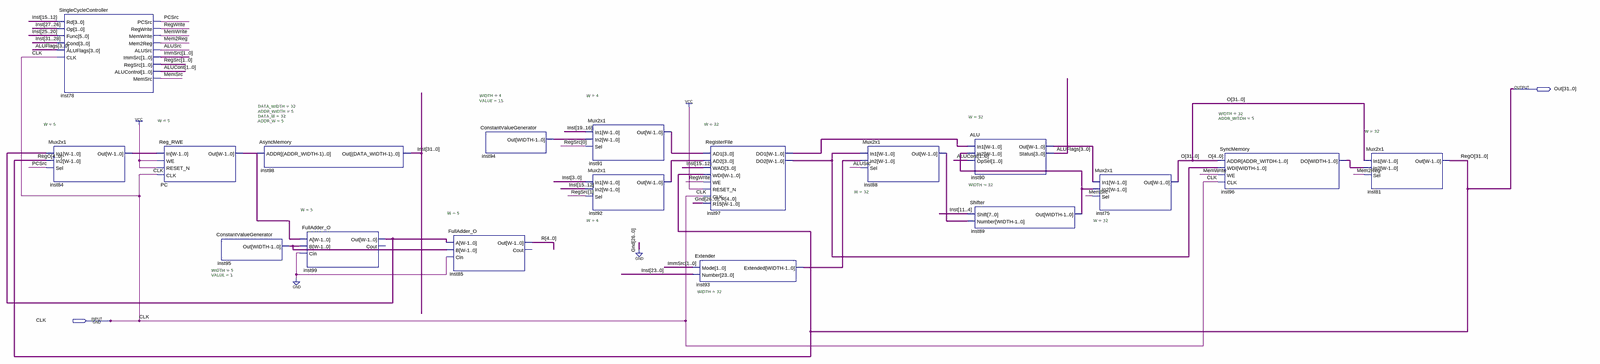
[diagram p0: schematic sheet, whole]
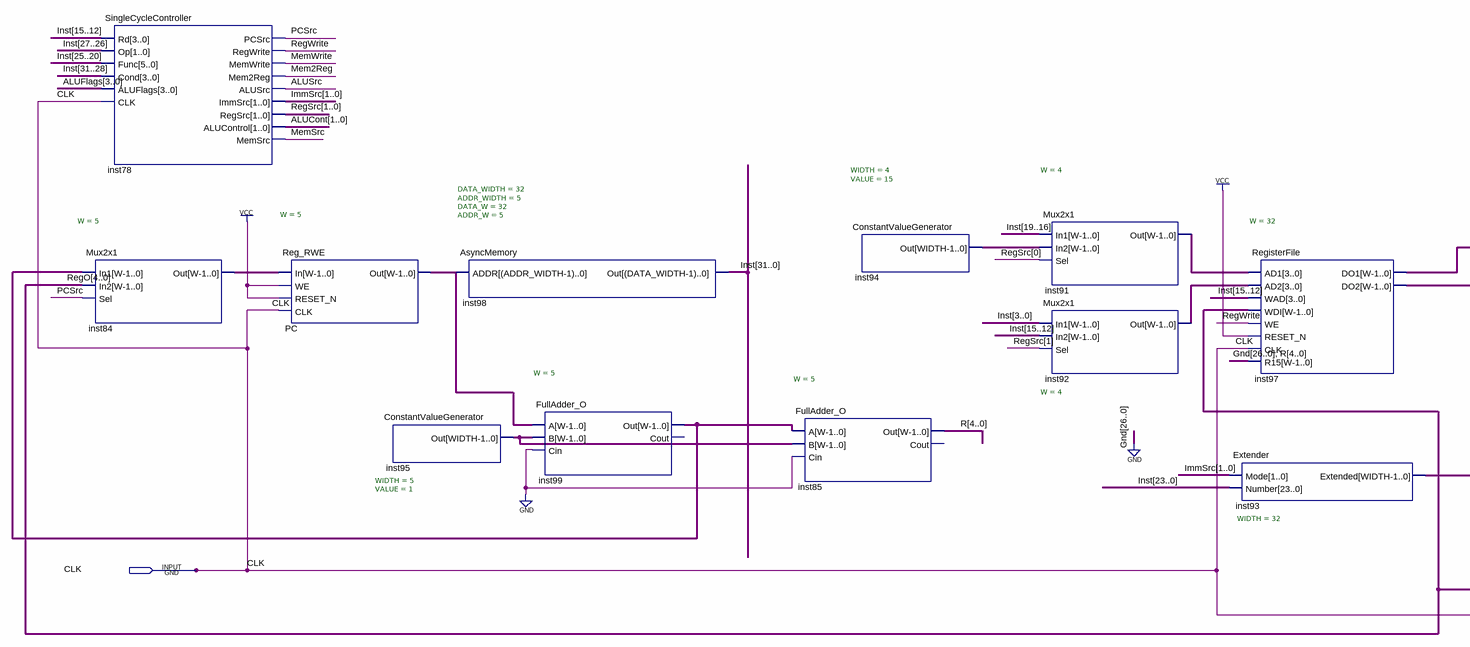
[diagram p1: schematic sheet, left part]
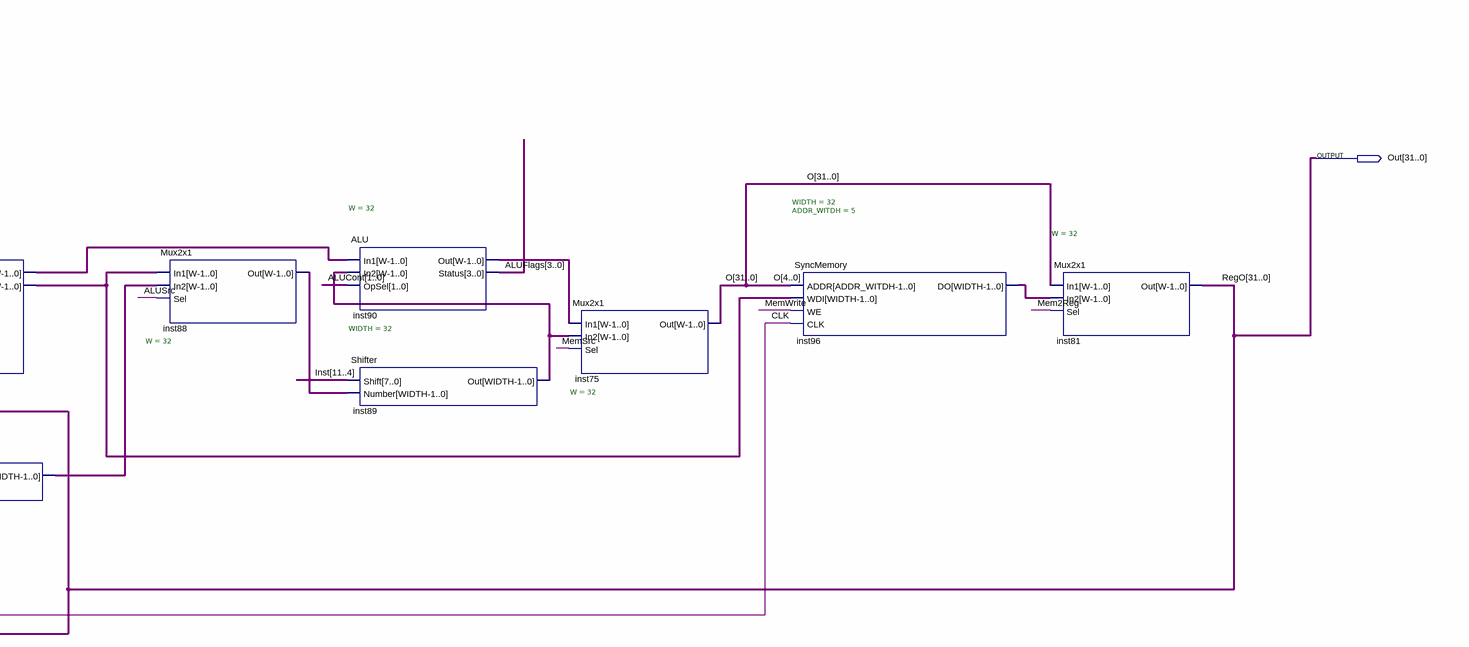
[diagram p2: schematic sheet, right part]
// Quartus schematic SingleCycle.bdf as structural Verilog: 18 symbols, 2 pins
module SingleCycle (
  input  CLK,
  output [31:0] Out
);

  wire ALUSrc, Mem2Reg, MemSrc, MemWrite, PCSrc, RegWrite;
  wire [1:0] ALUCont, ImmSrc, RegSrc;
  wire [3:0] ALUFlags, inst91_out, inst92_out, inst94_out;
  wire [4:0] inst84_out, inst95_out, inst99_out, PC_out, R;
  wire [31:0] Inst, inst88_out, inst89_out, inst90_out, inst93_extended, inst96_do, inst97_do1, inst97_do2, O;

  SingleCycleController inst78 (
    .Rd(Inst[15:12]), .Op(Inst[27:26]), .Func(Inst[25:20]), .Cond(Inst[31:28]), .ALUFlags(ALUFlags),
    .CLK(CLK), .PCSrc(PCSrc), .RegWrite(RegWrite), .MemWrite(MemWrite), .Mem2Reg(Mem2Reg), .ALUSrc(ALUSrc),
    .ImmSrc(ImmSrc), .RegSrc(RegSrc), .ALUControl(ALUCont), .MemSrc(MemSrc));
  Mux2x1 #(.W(5)) inst84 (.In1(inst99_out), .In2(Out[4:0]), .Sel(PCSrc), .Out(inst84_out));
  Reg_RWE #(.W(5)) PC (.In(inst84_out), .WE(1'b1), .RESET_N(1'b1), .CLK(CLK), .Out(PC_out));
  ConstantValueGenerator #(.WIDTH(5), .VALUE(1)) inst95 (.Out(inst95_out));
  AsyncMemory #(.DATA_WIDTH(32), .ADDR_WIDTH(5), .DATA_W(32), .ADDR_W(5)) inst98 (.ADDR(PC_out), .Out(Inst));
  FullAdder_O #(.W(5)) inst99 (.A(PC_out), .B(inst95_out), .Cin(1'b0), .Out(inst99_out));  // open: Cout
  FullAdder_O #(.W(5)) inst85 (.A(inst99_out), .B(inst95_out), .Cin(1'b0), .Out(R));  // open: Cout
  ConstantValueGenerator #(.WIDTH(4), .VALUE(15)) inst94 (.Out(inst94_out));
  Mux2x1 #(.W(4)) inst91 (.In1(Inst[19:16]), .In2(inst94_out), .Sel(RegSrc[0]), .Out(inst91_out));
  Mux2x1 #(.W(4)) inst92 (.In1(Inst[3:0]), .In2(Inst[15:12]), .Sel(RegSrc[1]), .Out(inst92_out));
  RegisterFile #(.W(32)) inst97 (
    .AD1(inst91_out), .AD2(inst92_out), .WAD(Inst[15:12]), .WDI(Out), .WE(RegWrite), .RESET_N(1'b1),
    .CLK(CLK), .R15({{27{1'b0}}, R}), .DO1(inst97_do1), .DO2(inst97_do2));
  Extender #(.WIDTH(32)) inst93 (.Mode(ImmSrc), .Number(Inst[23:0]), .Extended(inst93_extended));
  Mux2x1 #(.W(32)) inst88 (.In1(inst97_do2), .In2(inst93_extended), .Sel(ALUSrc), .Out(inst88_out));
  ALU #(.W(32)) inst90 (.In1(inst97_do1), .In2(inst89_out), .OpSel(ALUCont), .Out(inst90_out), .Status(ALUFlags));
  Shifter #(.WIDTH(32)) inst89 (.Shift(Inst[11:4]), .Number(inst88_out), .Out(inst89_out));
  Mux2x1 #(.W(32)) inst75 (.In1(inst90_out), .In2(inst89_out), .Sel(MemSrc), .Out(O));
  SyncMemory #(.WIDTH(32), .ADDR_WITDH(5)) inst96 (
    .ADDR(O[4:0]), .WDI(inst97_do2), .WE(MemWrite), .CLK(CLK), .DO(inst96_do));
  Mux2x1 #(.W(32)) inst81 (.In1(O), .In2(inst96_do), .Sel(Mem2Reg), .Out(Out));

  // Other names for the same wires on the sheet: RegO[31:0] = Out
endmodule
